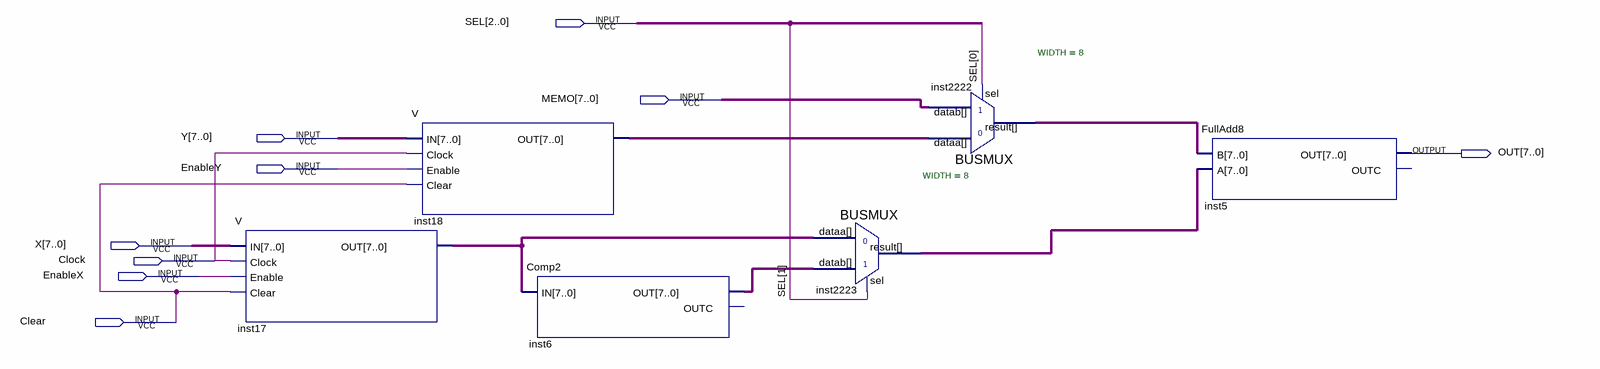
[diagram p0: schematic sheet]
// Quartus schematic Execute.bdf as structural Verilog: 6 symbols, 9 pins
module Execute (
  input  [2:0] SEL,
  input  [7:0] MEMO,
  input  [7:0] Y,
  input  EnableY,
  input  [7:0] X,
  input  Clock,
  input  EnableX,
  input  Clear,
  output [7:0] OUT
);

  wire [7:0] inst6_out, inst17_out, inst18_out, inst2222_result, inst2223_result;

  V inst17 (.IN(X), .Clock(Clock), .Enable(EnableX), .Clear(Clear), .OUT(inst17_out));
  V inst18 (.IN(Y), .Clock(Clock), .Enable(EnableY), .Clear(Clear), .OUT(inst18_out));
  Comp2 inst6 (.IN(inst17_out), .OUT(inst6_out));  // open: OUTC
  BUSMUX #(.WIDTH(8)) inst2223 (.datab(inst6_out), .sel(SEL[1]), .dataa(inst17_out), .result(inst2223_result));
  BUSMUX #(.WIDTH(8)) inst2222 (.datab(MEMO), .sel(SEL[0]), .dataa(inst18_out), .result(inst2222_result));
  FullAdd8 inst5 (.B(inst2222_result), .A(inst2223_result), .OUT(OUT));  // open: OUTC
endmodule
